# EAGLE design sensor (EAGLE 6.5.0)
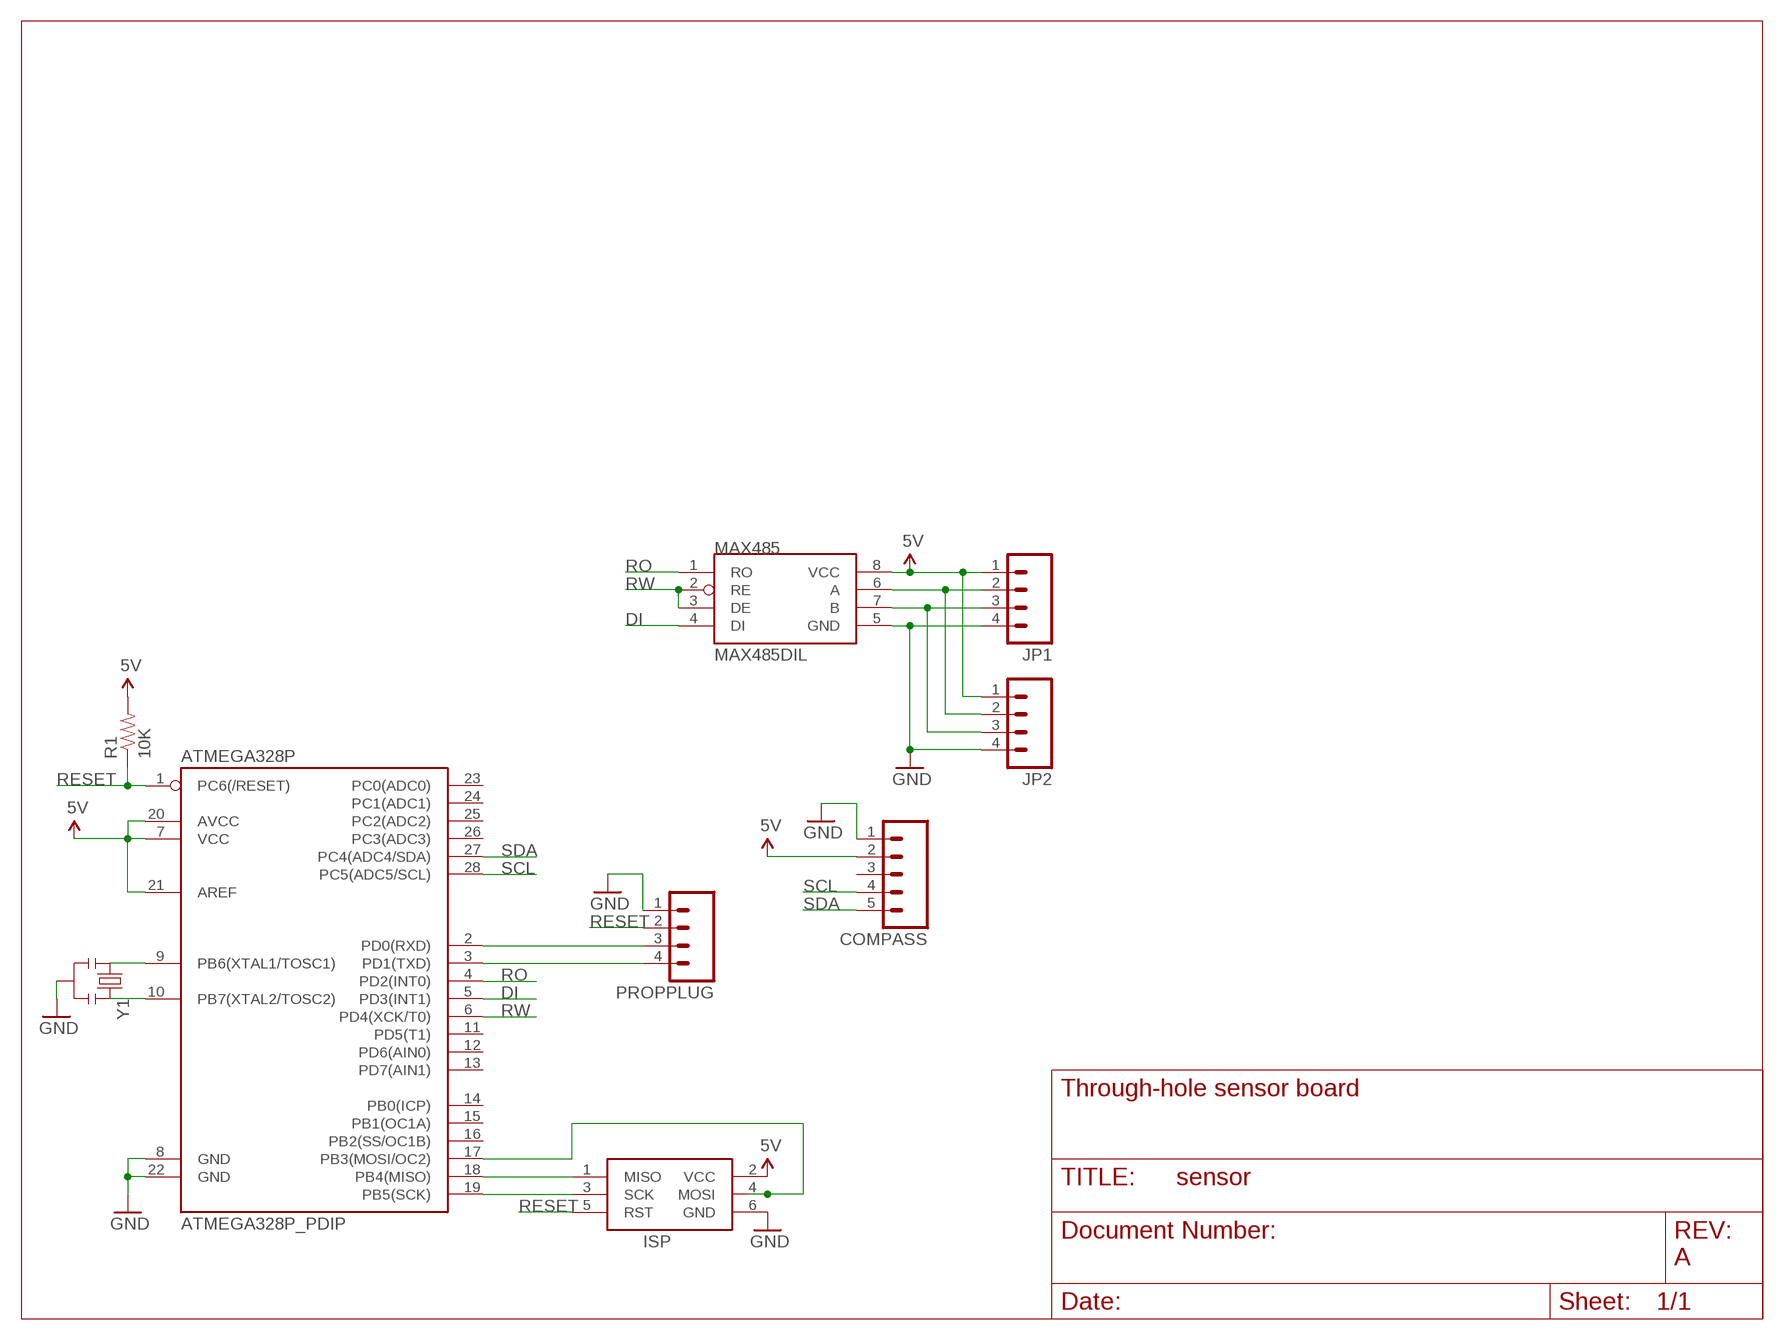
[diagram p0: schematic, sheet 1]

## Parts
ATMEGA328P  ATMEGA328P_PDIP  [DIL28-3]
COMPASS  M05PTH  [1X05]
ISP  AVRISP-6  [AVRISP]
JP1  M04PTH  [1X04]
JP2  M04PTH  [1X04]
MAX485  MAX485DIL  [DIL08]
PROPPLUG  M04PTH  [1X04]
R1  10K  RESISTORPTH-1/4W  [AXIAL-0.4]
Y1  RESONATORPTH  [RESONATOR-PTH]

## Nets
5V: ATMEGA328P.7(VCC) ATMEGA328P.20(AVCC) ATMEGA328P.21(AREF) COMPASS.2 ISP.2(VCC) JP1.1 JP2.1 MAX485.8(VCC) R1.P$2
DI: ATMEGA328P.5(PD3(INT1)) MAX485.4(DI)
GND: ATMEGA328P.8(GND) ATMEGA328P.22(GND) COMPASS.1 ISP.6(GND) JP1.4 JP2.4 MAX485.5(GND) PROPPLUG.1 Y1.2
N$1: ATMEGA328P.10(PB7(XTAL2/TOSC2)) Y1.3
N$2: ATMEGA328P.9(PB6(XTAL1/TOSC1)) Y1.1
N$3: ATMEGA328P.18(PB4(MISO)) ISP.1(MISO)
N$4: ATMEGA328P.19(PB5(SCK)) ISP.3(SCK)
N$5: ATMEGA328P.17(PB3(MOSI/OC2)) ISP.4(MOSI)
N$8: ATMEGA328P.2(PD0(RXD)) PROPPLUG.3
N$9: ATMEGA328P.3(PD1(TXD)) PROPPLUG.4
N$12: JP1.3 JP2.3 MAX485.7(B)
N$13: JP1.2 JP2.2 MAX485.6(A)
RESET: ATMEGA328P.1(PC6(/RESET)) ISP.5(RST) PROPPLUG.2 R1.P$1
RO: ATMEGA328P.4(PD2(INT0)) MAX485.1(RO)
RW: ATMEGA328P.6(PD4(XCK/T0)) MAX485.2(RE) MAX485.3(DE)
SCL: ATMEGA328P.28(PC5(ADC5/SCL)) COMPASS.4
SDA: ATMEGA328P.27(PC4(ADC4/SDA)) COMPASS.5
Unconnected: ATMEGA328P.11(PD5(T1)) ATMEGA328P.12(PD6(AIN0)) ATMEGA328P.13(PD7(AIN1)) ATMEGA328P.14(PB0(ICP)) ATMEGA328P.15(PB1(OC1A)) ATMEGA328P.16(PB2(SS/OC1B)) ATMEGA328P.23(PC0(ADC0)) ATMEGA328P.24(PC1(ADC1)) ATMEGA328P.25(PC2(ADC2)) ATMEGA328P.26(PC3(ADC3)) COMPASS.3

## Notes on the sheet
- Through-hole sensor board
- A

## Library data of the parts
ATMEGA328P = SparkFun-DigitalIC:ATMEGA328P_PDIP: uC used in the Arduino 32kb flash, 1k EEPROM, 2k SRAM This is the through-hole version of this chip.
COMPASS = SparkFun-Connectors:M05: Header 5 Standard 5-pin 0.1" header. Use with straight break away headers (SKU : PRT-00116), right angle break away headers (PRT-00553), swiss pins (PRT-00743), machine pins (PRT-00117), and female headers (PRT-00115). Molex polarized connector foot print use with SKU : PRT-08230 with associated crimp pins and housings.
ISP = adafruit:AVRISP: AVR ISP HEADER Standard 6 pin header for AVR programming
JP1 JP2 PROPPLUG = SparkFun-Connectors:M04: Header 4 Standard 4-pin 0.1" header. Use with straight break away headers (SKU : PRT-00116), right angle break away headers (PRT-00553), swiss pins (PRT-00743), machine pins (PRT-00117), and female headers (PRT-00115). Molex polarized connector foot print use with SKU : PRT-08231 with associated crimp pins and housings. 1MM SMD Version SKU: PRT-10208
MAX485 = SparkFun-DigitalIC:MAX485: RS-485 transceiver
R1 = SparkFun-Resistors:RESISTOR: Resistor Basic schematic elements and footprints for 0603, 1206, and PTH resistors.
Y1 = SparkFun-FreqCtrl:RESONATOR: Resonator Small SMD resonator. Used, eg, on the Arduino Pro/ Pro Mini boards. 8MHz- XTAL-08895 16MHz- XTAL-08900

## Board
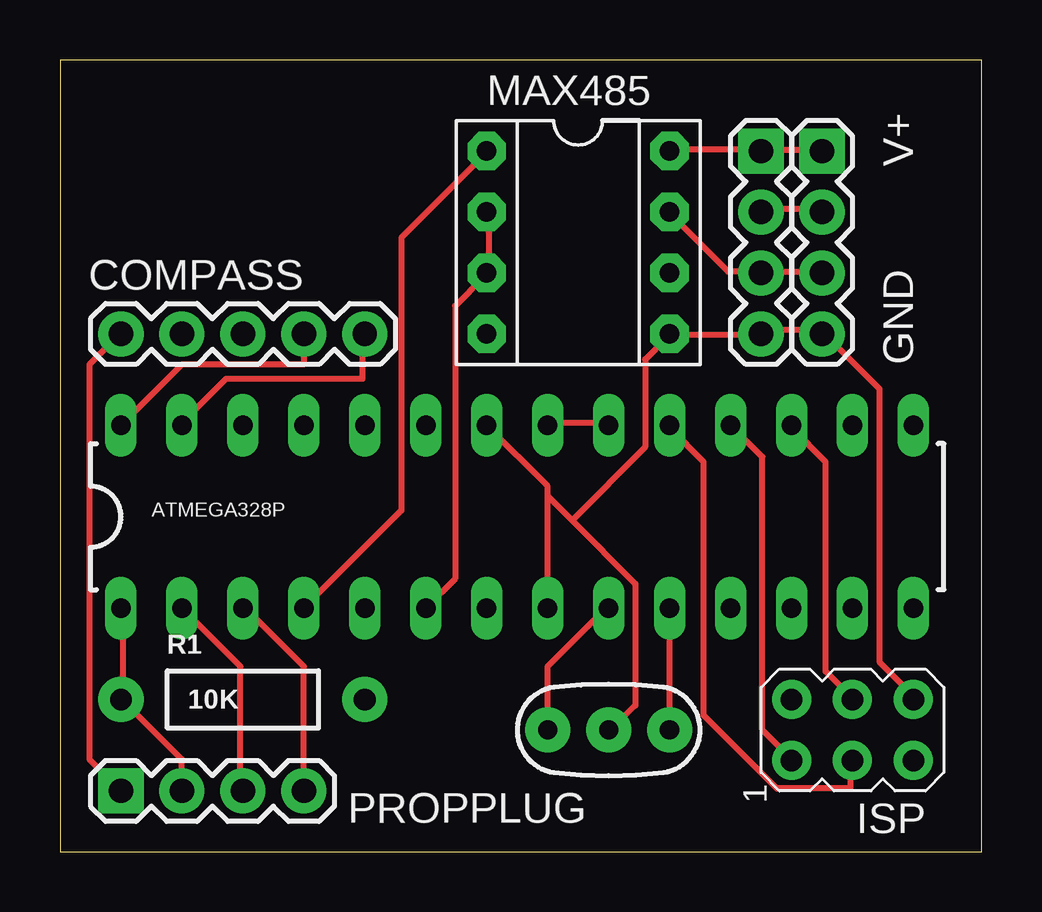
[diagram p1: board, top side]
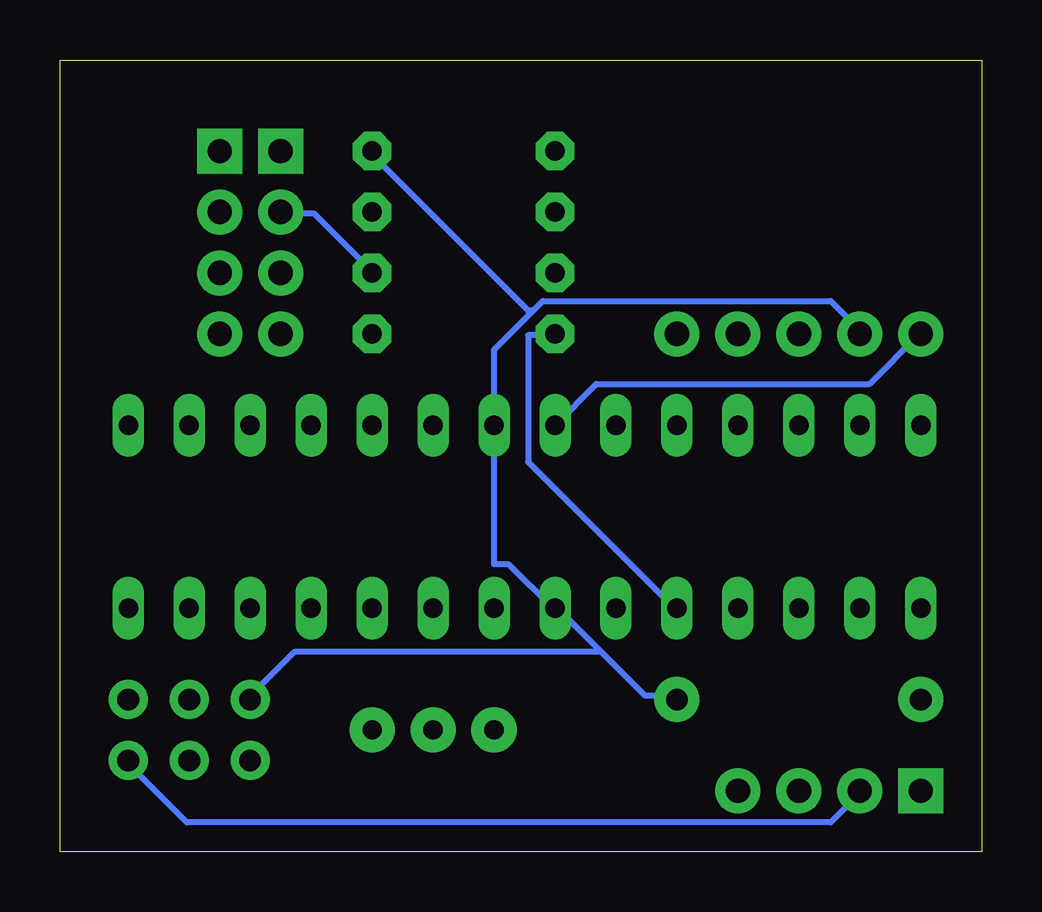
[diagram p2: board, bottom side, seen from below]

Size 38.41 x 33.01 mm. Coordinates in mm from the lower left corner, seen from the top.
Outline: 0,0 38.41,0 38.41,33.01 0,33.01 0,0
Copper layers (1*16): Top 0.035mm / dielectric 1.5mm / Bottom 0.035mm
Design rules "default": minimum track width 10mil, minimum drill 24mil, track to track 8mil, track to pad 8mil, pad to pad 8mil, via to via 8mil, smd to smd 8mil, copper to edge 40mil, drill to drill 8mil, minimum pad ring 10mil, minimum via ring 8mil, stop-mask expansion 4mil, vias tented up to drill 0mil, thermal gap 10mil

### Footprints (pad centres in the part's own frame; a part is rotated, then mirrored left to right if it is on the bottom)
DIL28-3 = drill 0.813 long: 1 -16.51,-3.81; 2 -13.97,-3.81; 3 -11.43,-3.81; 4 -8.89,-3.81; 5 -6.35,-3.81; 6 -3.81,-3.81; 7 -1.27,-3.81; 8 1.27,-3.81; 9 3.81,-3.81; 10 6.35,-3.81; 11 8.89,-3.81; 12 11.43,-3.81; 13 13.97,-3.81; 14 16.51,-3.81; 15 16.51,3.81; 16 13.97,3.81; 17 11.43,3.81; 18 8.89,3.81; 19 6.35,3.81; 20 3.81,3.81; 21 1.27,3.81; 22 -1.27,3.81; 23 -3.81,3.81; 24 -6.35,3.81; 25 -8.89,3.81; 26 -11.43,3.81; 27 -13.97,3.81; 28 -16.51,3.81
1X05 = drill 1.016 pad 1.88: 1 0,0; 2 2.54,0; 3 5.08,0; 4 7.62,0; 5 10.16,0
AVRISP = drill 0.9 pad 1.626: 1 -1.27,2.54; 2 1.27,2.54; 3 -1.27,0; 4 1.27,0; 5 -1.27,-2.54; 6 1.27,-2.54
1X04 = drill 1.016 pad 1.88 square: 1 0,0 | drill 1.016 pad 1.88: 2 2.54,0; 3 5.08,0; 4 7.62,0
DIL08 = drill 0.813 pad 1.6 octagon: 1 -3.81,-3.81; 2 -1.27,-3.81; 3 1.27,-3.81; 4 3.81,-3.81; 5 3.81,3.81; 6 1.27,3.81; 7 -1.27,3.81; 8 -3.81,3.81
AXIAL-0.4 = drill 0.9 pad 1.88: P$1 -5.08,0; P$2 5.08,0
RESONATOR-PTH = drill 0.8 pad 1.88: 1 -2.54,0; 2 0,0; 3 2.54,0

### Placement (x,y rotation side)
ATMEGA328P  19.05,13.97 0 top
COMPASS  2.54,21.59 0 top
ISP  33.02,5.08 90 top
JP1  31.75,29.21 270 top
JP2  29.21,29.21 270 top
MAX485  21.59,25.4 270 top
PROPPLUG  2.54,2.54 0 top
R1  7.62,6.35 0 top
Y1  22.86,5.08 0 top

### Tracks (layer width: path | path; a pad name or v marks a point on that pad's centre or on a via)
5V
  Top 0.254: MAX485.8 25.4,29.26 29.06,29.26 JP2.1 29.26,29.26 31.7,29.26 JP1.1 | ATMEGA328P.21 20.32,17.88 22.76,17.88 ATMEGA328P.20
  Bottom 0.254: 15.85,8.33 14.02,6.5 12.8,6.5 R1.P$2 | 15.85,8.33 17.68,10.16 ATMEGA328P.7 17.88,10.16 19.71,11.99 20.32,11.99 ATMEGA328P.21 20.32,20.93 18.69,22.55 | 15.85,8.33 28.65,8.33 30.48,6.5 ISP.2 | 18.69,22.55 18.29,22.96 6.3,22.96 5.08,21.74 COMPASS.2 | 18.69,22.55 18.9,22.55 25.4,29.06 MAX485.8
DI
  Bottom 0.254: ATMEGA328P.5 12.8,10.16 18.9,16.26 18.9,21.54 17.88,21.54 MAX485.4
GND
  Top 0.254: PROPPLUG.1 1.22,3.86 1.22,20.32 2.44,21.54 COMPASS.1 | ATMEGA328P.22 20.32,15.24 20.32,14.83 | ATMEGA328P.8 20.32,14.83 | 20.32,14.83 21.34,13.82 | 21.34,13.82 23.98,11.18 23.98,6.1 22.96,5.08 Y1.2 | 25.4,21.54 29.06,21.54 JP2.4 29.26,21.74 31.7,21.74 JP1.4 31.9,21.54 34.14,19.3 34.14,7.92 35.56,6.5 ISP.6 | 21.34,13.82 24.38,16.87 24.38,20.52 25.4,21.54 | 25.4,21.54 MAX485.5
  Bottom 0.254: ATMEGA328P.22 16.05,19.51 4.67,19.51 2.64,21.54 COMPASS.1
N$1
  Top 0.254: Y1.3 ATMEGA328P.10
N$2
  Top 0.254: Y1.1 20.32,7.72 22.76,10.16 ATMEGA328P.9
N$3
  Top 0.254: ATMEGA328P.18 29.26,16.46 29.26,5.08 30.48,3.86 ISP.1
N$4
  Top 0.254: ATMEGA328P.19 25.4,17.68 26.82,16.26 26.82,5.69 29.87,2.64 32.92,2.64 32.92,3.66 ISP.3
N$5
  Top 0.254: ATMEGA328P.17 30.48,17.68 31.9,16.26 31.9,7.52 32.92,6.5 ISP.4
N$8
  Top 0.254: ATMEGA328P.2 7.52,7.72 7.52,2.64 PROPPLUG.3
N$9
  Top 0.254: PROPPLUG.4 10.16,7.72 7.72,10.16 ATMEGA328P.3
N$12
  Top 0.254: MAX485.7 25.4,26.62 27.84,24.18 29.06,24.18 JP2.3 29.26,24.18 31.7,24.18 JP1.3
N$13
  Top 0.254: JP1.2 31.7,26.82 29.26,26.82 JP2.2
  Bottom 0.254: MAX485.6 25.4,24.18 27.84,26.62 29.06,26.62 JP2.2
RESET
  Top 0.254: ATMEGA328P.1 2.64,10.16 2.64,6.5 R1.P$1 2.64,6.3 5.08,3.86 PROPPLUG.2
  Bottom 0.254: ISP.5 35.56,3.66 33.12,1.22 6.3,1.22 5.08,2.44 PROPPLUG.2
RO
  Top 0.254: ATMEGA328P.4 14.22,14.22 14.22,25.6 17.68,29.06 MAX485.1
RW
  Top 0.254: ATMEGA328P.6 16.46,11.38 16.46,22.76 17.68,23.98 MAX485.3 17.88,24.18 17.88,26.62 MAX485.2
SCL
  Top 0.254: ATMEGA328P.28 5.08,20.32 10.16,20.32 COMPASS.4
SDA
  Top 0.254: ATMEGA328P.27 5.08,17.88 6.91,19.71 12.6,19.71 12.6,21.54 COMPASS.5

### Text on the board
tPlace: V+ | GND